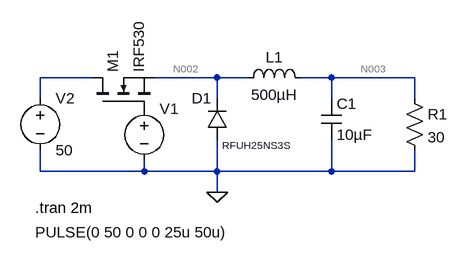
[diagram p0: schematic Buck Converter.asc]
Buck Converter.asc, the LTspice schematic file:
Version 4
SHEET 1 880 680
WIRE -32 112 -112 112
WIRE 160 112 64 112
WIRE 208 112 160 112
WIRE 336 112 288 112
WIRE 464 112 336 112
WIRE -112 144 -112 112
WIRE 160 144 160 112
WIRE 336 144 336 112
WIRE 464 144 464 112
WIRE -112 256 -112 224
WIRE 48 256 48 240
WIRE 48 256 -112 256
WIRE 160 256 160 208
WIRE 160 256 48 256
WIRE 336 256 336 208
WIRE 336 256 160 256
WIRE 464 256 464 224
WIRE 464 256 336 256
WIRE 160 288 160 256
FLAG 160 288 0
SYMBOL diode 176 208 R180
WINDOW 0 24 64 Left 2
WINDOW 3 -96 -8 Left 1
SYMATTR InstName D1
SYMATTR Value RFUH25NS3S
SYMBOL ind 192 128 R270
WINDOW 0 32 56 VTop 2
WINDOW 3 5 56 VBottom 2
SYMATTR InstName L1
SYMATTR Value 500µH
SYMBOL cap 320 144 R0
SYMATTR InstName C1
SYMATTR Value 10µF
SYMBOL res 448 128 R0
SYMATTR InstName R1
SYMATTR Value 30
SYMBOL nmos -32 160 R270
SYMATTR InstName M1
SYMATTR Value IRF530
SYMBOL voltage 48 144 R0
WINDOW 3 -168 206 Left 2
WINDOW 123 0 0 Left 0
WINDOW 39 0 0 Left 0
SYMATTR Value PULSE(0 50 0 0 0 25u 50u)
SYMATTR InstName V1
SYMBOL voltage -112 128 R0
WINDOW 123 0 0 Left 0
WINDOW 39 0 0 Left 0
SYMATTR InstName V2
SYMATTR Value 50
TEXT -120 312 Left 2 !.tran 2m

The netlist it stands for:
* Buck Converter.asc
D1 0 N002 RFUH25NS3S
L1 N002 N003 500µH
C1 N003 0 10µF
R1 N003 0 30
M1 N001 P001 N002 N002 IRF530
V1 P001 0 PULSE(0 50 0 0 0 25u 50u)
V2 N001 0 50
.model D D
.lib standard.dio
.model NMOS NMOS
.model PMOS PMOS
.lib standard.mos
.tran 2m
.backanno
.end

* Results of the author's LTspice run, read from the files saved beside the schematic
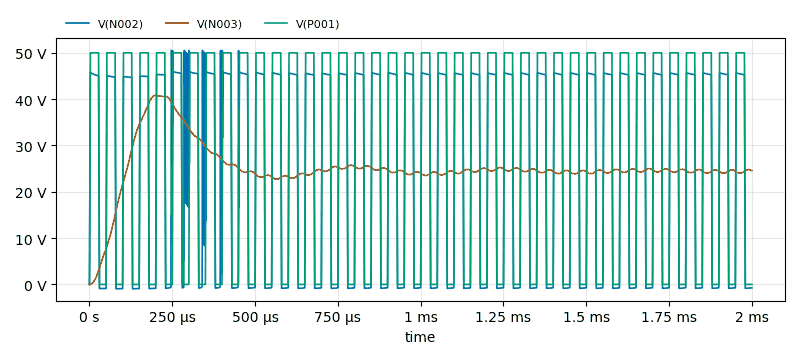
[diagram p1: Transient Analysis of Buck Converter.asc, plotted from the saved traces]
* Transient Analysis, 1 run:
*   V(N002): min -940.6 mV, max 50.53 V, average 25.15 V, rms 33.52 V, last -731.4 mV
*   V(N003): min 0 V, max 40.8 V, average 25.07 V, rms 25.7 V, last 24.54 V
*   V(P001): min 0 V, max 50 V, average 27.5 V, rms 36.53 V, last 0 V